# Altium schematic sheet sketch.SchDoc
size A
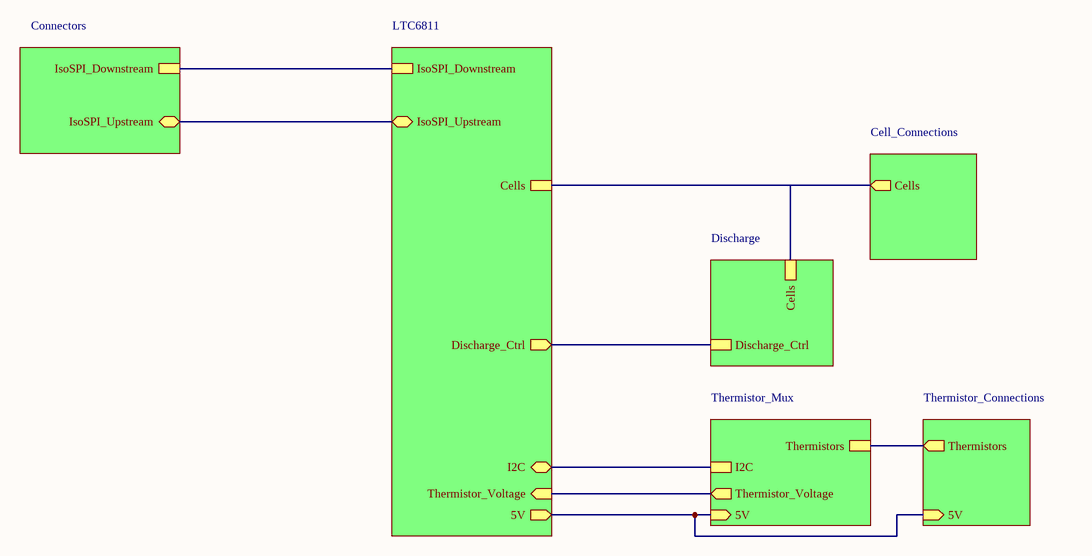
[diagram p0: sketch.SchDoc]

## Sub-sheets
Cell_Connections = ?: Cells (out, harness Harness)
Connectors = ?: IsoSPI_Downstream (harness Harness), IsoSPI_Upstream (bidir, harness Harness)
Discharge = ?: Cells (harness Harness), Discharge_Ctrl (harness Harness)
LTC6811 = ?: IsoSPI_Downstream (harness Harness), IsoSPI_Upstream (bidir, harness Harness), I2C (bidir, harness Harness), Thermistor_Voltage (in), Cells (harness Harness), Discharge_Ctrl (out, harness Harness), 5V (out)
Thermistor_Connections = ?: Thermistors (out, harness Harness), 5V (in)
Thermistor_Mux = ?: I2C (harness Harness), Thermistor_Voltage (out), Thermistors (harness Harness), 5V (in)

## Nets
(unnamed): sheet LTC6811/Thermistor_Voltage, sheet Thermistor_Mux/Thermistor_Voltage
(unnamed): sheet LTC6811/5V, sheet Thermistor_Mux/5V, sheet Thermistor_Connections/5V